# Altium project sdc_prech_proj.PrjPCB (part 1 of 2)
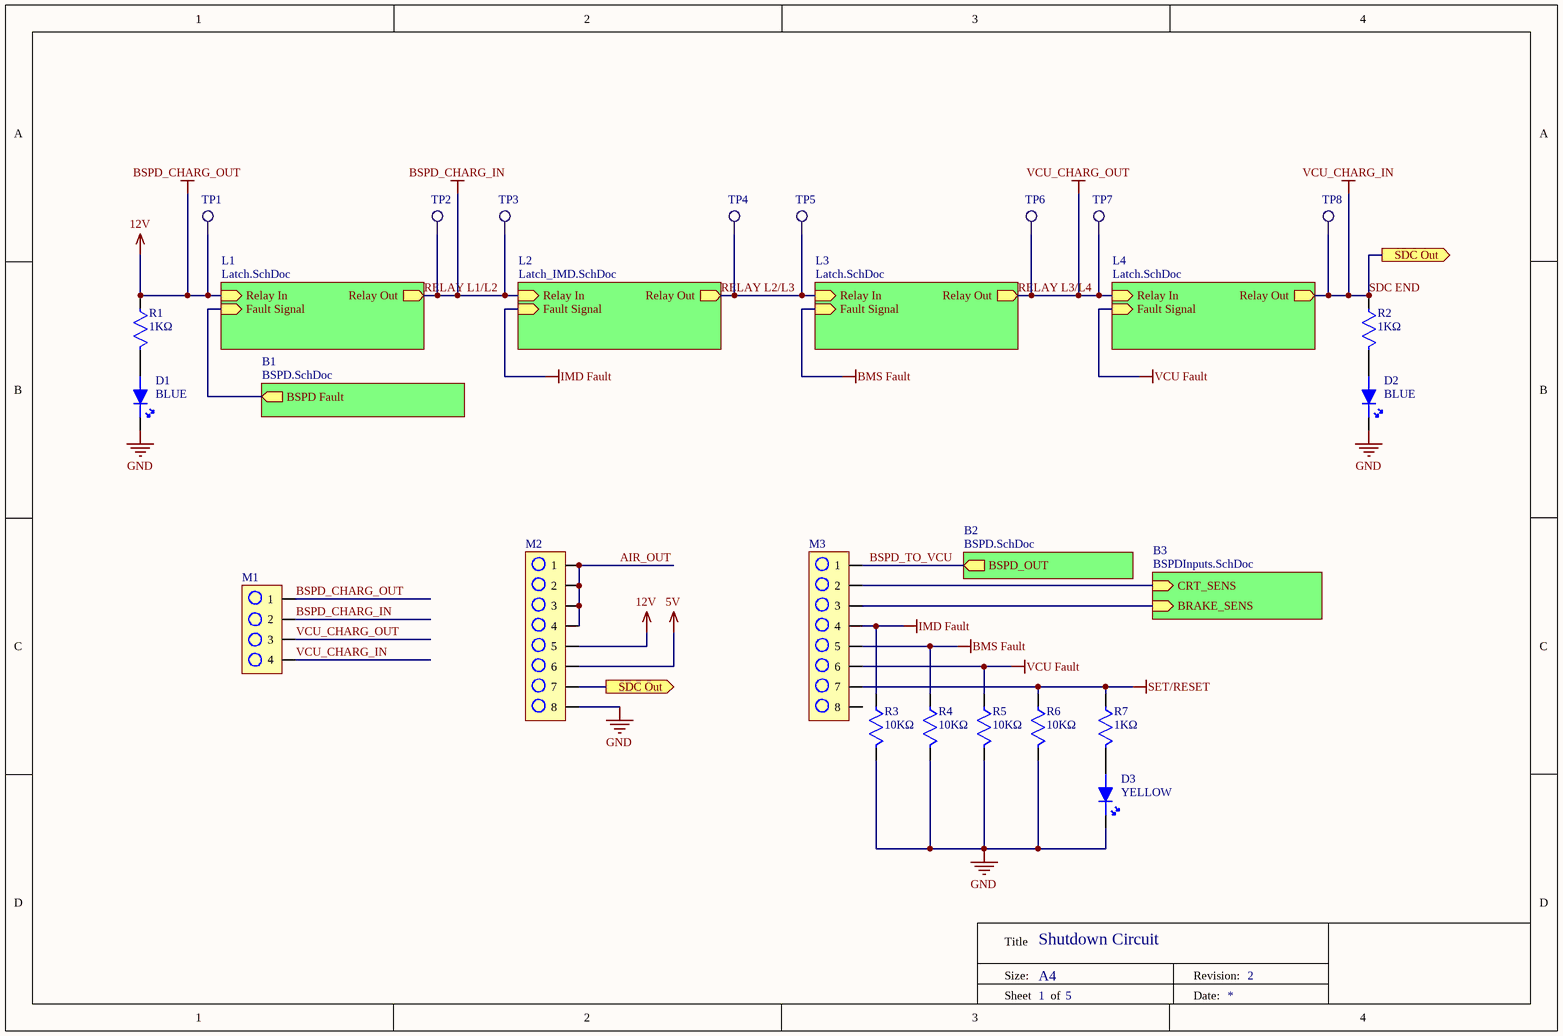
[diagram p0: shutdown_circuit.SchDoc]
5 sheets, 120 parts. Net scope: hierarchical (ports join the sheet entries above them; power ports are global).
Board files: sdc_no-prech_pcb.PcbDoc, sdc_bspd_no-prech_pcb.PcbDoc
Sheets:
  shutdown_circuit.SchDoc
    L1 = Latch.SchDoc
    L2 = Latch_IMD.SchDoc
    L3 = Latch.SchDoc
    L4 = Latch.SchDoc
    B1 = BSPD.SchDoc
      B4 = BSPDInputs.SchDoc
    B3 = BSPDInputs.SchDoc
    B2 = BSPD.SchDoc
      B4 = BSPDInputs.SchDoc

## Sheet shutdown_circuit.SchDoc
size A4

### Parts
D1  BLUE  [LED 0603]
D2  BLUE  [LED 0603]
D3  YELLOW  [LED 0603]
M1  0436500428  [4-PIN MOLEX]  (value not drawn)
M2  2068320802  [4X2-PIN MOLEX]  (value not drawn)
M3  2068320802  [4X2-PIN MOLEX]  (value not drawn)
R1  1KΩ  [RESISTOR 0603]
R2  1KΩ  [RESISTOR 0603]
R3  10KΩ  [RESISTOR 0603]
R4  10KΩ  [RESISTOR 0603]
R5  10KΩ  [RESISTOR 0603]
R6  10KΩ  [RESISTOR 0603]
R7  1KΩ  [RESISTOR 0603]
TP1  Testpoint2  [TP2]  (value not drawn)
TP2  Testpoint2  [TP2]  (value not drawn)
TP3  Testpoint2  [TP2]  (value not drawn)
TP4  Testpoint2  [TP2]  (value not drawn)
TP5  Testpoint2  [TP2]  (value not drawn)
TP6  Testpoint2  [TP2]  (value not drawn)
TP7  Testpoint2  [TP2]  (value not drawn)
TP8  Testpoint2  [TP2]  (value not drawn)

### Sub-sheets
B1 = BSPD.SchDoc: BSPD Fault (out)
B2 = BSPD.SchDoc: BSPD_OUT (out)
B3 = BSPDInputs.SchDoc: CRT_SENS (in), BRAKE_SENS (in)
L1 = Latch.SchDoc: Relay In (in), Relay Out (out), Fault Signal (in)
L2 = Latch_IMD.SchDoc: Relay In (in), Relay Out (out), Fault Signal (in)
L3 = Latch.SchDoc: Relay In (in), Relay Out (out), Fault Signal (in)
L4 = Latch.SchDoc: Relay In (in), Relay Out (out), Fault Signal (in)

### Ports
SDC Out (out)

### Nets
5V: M2.6
BMS Fault: M3.5 R4.1 ; sheet L3/Fault Signal
BSPD_CHARG_IN: M1.2 TP2.1 TP3.1 ; sheet L1/Relay Out, sheet L2/Relay In  [also labelled RELAY L1/L2]
BSPD_CHARG_OUT: M1.1 M2.5 R1.1 TP1.1 ; sheet L1/Relay In  [also labelled 12V]
GND: D1.2 D2.2 D3.2 M2.8 R3.2 R4.2 R5.2 R6.2
IMD Fault: M3.4 R3.1 ; sheet L2/Fault Signal
RELAY L3/L4: M1.3 TP6.1 TP7.1 ; sheet L3/Relay Out, sheet L4/Relay In  [also labelled VCU_CHARG_OUT]
SDC END: M1.4 M2.7 R2.1 TP8.1 ; port SDC Out, sheet L4/Relay Out  [also labelled VCU_CHARG_IN]
SET/RESET: M3.7 R6.1 R7.1
VCU Fault: M3.6 R5.1 ; sheet L4/Fault Signal
AIR_OUT: M2.1 M2.2 M2.3 M2.4
BSPD_TO_VCU: M3.1 ; sheet B2/BSPD_OUT
RELAY L2/L3: TP4.1 TP5.1 ; sheet L2/Relay Out, sheet L3/Relay In
NetD1_1: D1.1 R1.2
NetD2_1: D2.1 R2.2
NetD3_1: D3.1 R7.2
NetM3_2: M3.2 ; sheet B3/CRT_SENS
NetM3_3: M3.3 ; sheet B3/BRAKE_SENS
NetU1_L2_5: sheet L1/Fault Signal, sheet B1/BSPD Fault

Not connected (* = marked no-connect by the designer): M3 8

### Notes on the sheet
- Shutdown Circuit
- 2
- 1
- 5
- Title
- Size:
- A4
- Revision:
- Sheet
- of
- Date:

### Library data of the parts
D1 D2 = LTST-C191TBKT-5A: LED BLUE CLEAR CHIP SMD; Manufacturer: Vishay Lite-On; Lens Color: Colorless; Lens Style: Diffused,Colorless,Rectangular; Viewing Angle: 130°; Forward Current: 20mA; Forward Voltage: 2.8V; Luminous Intensity: 15mcd; Test Current: 5mA; Dominant Wavelength: 473nm; Number of LEDs: 1; Voltage: 29V; Supplier 1: Digi-Key; Manufacturer Part Number: LTST-C191TBKT-5A; Stock 1: 9654; Pricing 1: 1=0.5, 10=0.359, 100=0.1596, 500=0.11172, 1000=0.09177, 2500=0.0798 (USD); Mount: Surface Mount; Case/Package: 0603; Number of Pins: 2; Color: Blue; Case Code (Metric): 1608; Case Code (Imperial): 0603; Min Operating Temperature: -20°C; Max Operating Temperature: 80°C; Packaging: Tape and Reel; Package Quantity: 5000; Illumination Color: Blue; Lens Transparency: Clear; Length: 1.6mm; Height: 0.55mm; Width: 0.8mm; Radiation Hardening: No; ComponentLink1URL: http://optoelectronics.liteon.com/upload/download/DS22-2003-020/LTST-C191TBKT-5A.pdf?src-supplier=Digi-Key; ComponentLink1Description: http://optoelectronics.liteon.com/upload/download/DS22-2003-020/LTST-C191TBKT-5A.pdf?src-supplier=Digi-Key; ComponentLink2URL: http://components.arrow.com/part/dataview/52218576S9813001N1331?src-supplier=Arrow; ComponentLink2Description: http://components.arrow.com/part/dataview/52218576S9813001N1331?src-supplier=Arrow; ComponentLink3URL: http://optoelectronics.liteon.com/zh-cn/api/DwonloadFileHandler.ashx?txtSpecNo=DS22-2003-020&txtPartNo=LTST-C191TBKT-5A&src-supplier=Avnet; ComponentLink3Description: http://optoelectronics.liteon.com/zh-cn/api/DwonloadFileHandler.ashx?txtSpecNo=DS22-2003-020&txtPartNo=LTST-C191TBKT-5A&src-supplier=Avnet; ComponentLink4URL: http://www.mouser.com/ds/2/239/LTST-C191TBKT-5A-1150649.pdf?src-supplier=Mouser; ComponentLink4Description: http://www.mouser.com/ds/2/239/LTST-C191TBKT-5A-1150649.pdf?src-supplier=Mouser; Supplier Part Number 1: 160-2212-6-ND; Category: Optoelectronics
D3 = LTST-C191KSKT: LED YELLOW CLEAR SMD; Manufacturer: Vishay Lite-On; Lens Color: Colorless; Viewing Angle: 130°; Lens Style: Diffused,Colorless,Rectangular,Clear; Luminous Intensity: 180mcd; Forward Current: 30mA; Forward Voltage: 2.4V; Power Rating: 75mW; Dominant Wavelength: 597nm; Test Current: 20mA; Number of Elements: 1; Wavelength: 588nm; Reverse Voltage: 5V; Supplier 1: Digi-Key; Manufacturer Part Number: LTST-C191KSKT; Stock 1: 464545; Pricing 1: 1=0.29, 10=0.215, 100=0.1016, 500=0.06774, 1000=0.05306, 2500=0.05194 (USD); Mount: Surface Mount; Case/Package: 0603; Number of Pins: 2; Color: Yellow; Case Code (Metric): 1608; Case Code (Imperial): 0603; Min Operating Temperature: -55°C; Max Operating Temperature: 85°C; Package Quantity: 1; Packaging: Tape and Reel; Illumination Color: Yellow; Lens Transparency: Clear; Power Dissipation: 75mW; Number of LEDs: 1; Length: 1.6mm; Height: 0.55mm; Width: 0.8mm; Depth: 0.8mm; Radiation Hardening: No; Lead Free: Lead Free; ComponentLink1URL: http://optoelectronics.liteon.com/upload/download/DS22-2000-224/LTST-C191KSKT.PDF?src-supplier=Digi-Key; ComponentLink1Description: http://optoelectronics.liteon.com/upload/download/DS22-2000-224/LTST-C191KSKT.PDF?src-supplier=Digi-Key; ComponentLink2URL: https://www.verical.com/server-webapp/html/getDatasheet?partID=141495&src-supplier=Verical; ComponentLink2Description: https://www.verical.com/server-webapp/html/getDatasheet?partID=141495&src-supplier=Verical; ComponentLink3URL: http://www.mouser.com/ds/2/239/LTST-C191KSKT-1141271.pdf?src-supplier=Mouser; ComponentLink3Description: http://www.mouser.com/ds/2/239/LTST-C191KSKT-1141271.pdf?src-supplier=Mouser; ComponentLink4URL: http://www1.futureelectronics.com/doc/LITE%20ON/LITE-ON%20LTST-C191KSKT.pdf?src-supplier=Future+Electronics; ComponentLink4Description: http://www1.futureelectronics.com/doc/LITE%20ON/LITE-ON%20LTST-C191KSKT.pdf?src-supplier=Future+Electronics; Category: Optoelectronics; Supplier Part Number 1: 160-1448-6-ND
M1 = 0436500428: Conn Power HDR 4 POS 3mm Solder ST Thru-Hole 4 Terminal 1 Port Micro-Fit 3.0™ Tray; Manufacturer: Molex; Number of Positions: 4; Connector Type: Male Pin; Number of Ports: 1; Supplier 1: Digi-Key; Manufacturer Part Number: 0436500428; Stock 1: 1193; Pricing 1: 1=1.44, 10=1.265, 100=1.0916, 500=0.89316, 1000=0.79392, 5000=0.69468, 10000=0.65995 (USD); Mount: Through Hole; Contact Plating: Gold; Color: Black; Contact Material: Brass; Housing Material: Polymer; Number of Terminals: 4; Min Operating Temperature: -40°C; Max Operating Temperature: 105°C; Packaging: Tray; Number of Rows: 1; Termination: Solder; Fastening Type: Ramp; Number of Contacts: 4; Orientation: Straight; Package Quantity: 2040; Length: 15.65mm; Pitch: 3mm; Depth: 5.57mm; ComponentLink1URL: http://www.molex.com/pdm_docs/sd/436500428_sd.pdf?src-supplier=Digi-Key; ComponentLink1Description: http://www.molex.com/pdm_docs/sd/436500428_sd.pdf?src-supplier=Digi-Key; ComponentLink2URL: http://www.molex.com/webdocs/datasheets/pdf/en-us/0436500428_PCB_HEADERS.pdf?src-supplier=Avnet; ComponentLink2Description: http://www.molex.com/webdocs/datasheets/pdf/en-us/0436500428_PCB_HEADERS.pdf?src-supplier=Avnet; Supplier Part Number 1: WM10669-ND; Category: Connectors, Interconnects
M2 M3 = 2068320802: CONN HEADER 4X2 POS, 3.00mm Pitch; Vendor: Molex Connector Corporation; Built_By: Molex_Team; SourceLibrary: Molex_2020-09-22; Manufacturer_Part_Number: 2068320802; Copyright: Copyright (C) 2018 Accelerated Designs. All rights reserved; RefDes: RefDes; Type: DEV
R1 R2 R7 = CRCW06031K00FKEA: RES SMD 1K OHM 1% 1/10W 0603; Manufacturer: Vishay Dale; Resistance: 1kR; Temperature Coefficient: 100ppm/°C; Power Rating: 100mW; Voltage Rating: 75V; Supplier 1: Digi-Key; Manufacturer Part Number: CRCW06031K00FKEA; Stock 1: 1811474; Pricing 1: 1=0.1, 10=0.034, 100=0.0139, 1000=0.00623, 2500=0.0054 (USD); Mount: Surface Mount; Case/Package: 0603; Number of Pins: 2; Weight: 7.1E-05oz; Contact Plating: Tin; Case Code (Metric): 1608; Case Code (Imperial): 0603; Min Operating Temperature: -55°C; Max Operating Temperature: 155°C; Composition: Thick Film; Tolerance: 1%; Termination: SMD/SMT; Packaging: Tape and Reel; Package Quantity: 10; Number of Terminations: 2; Military Standard: Not; Max Power Dissipation: 100mW; Voltage Rating (DC): 75V; Features: Automotive AEC-Q200; Length: 1.55mm; Height: 0.45mm; Width: 0.033inch; Depth: 0.85mm; Radiation Hardening: No; Lead Free: Lead Free; REACH SVHC: Unknown; ComponentLink1URL: http://www.vishay.com/docs/20035/dcrcwe3.pdf?src-supplier=Digi-Key; ComponentLink1Description: http://www.vishay.com/docs/20035/dcrcwe3.pdf?src-supplier=Digi-Key; ComponentLink2URL: http://uk.rs-online.com/webdocs/0d98/0900766b80d98afc.pdf?src-supplier=RSComponents; ComponentLink2Description: http://uk.rs-online.com/webdocs/0d98/0900766b80d98afc.pdf?src-supplier=RSComponents; ComponentLink3URL: http://www.vishay.com/docs/20035/dcrcwe3.pdf?src-supplier=Avnet; ComponentLink3Description: http://www.vishay.com/docs/20035/dcrcwe3.pdf?src-supplier=Avnet; ComponentLink4URL: http://www.vishay.com/docs/20035/dcrcwe3.pdf?src-supplier=Avnet+Asia; ComponentLink4Description: http://www.vishay.com/docs/20035/dcrcwe3.pdf?src-supplier=Avnet+Asia; ComponentLink5URL: http://www.farnell.com/datasheets/2310790.pdf?src-supplier=Element14; ComponentLink5Description: http://www.farnell.com/datasheets/2310790.pdf?src-supplier=Element14; ComponentLink6URL: https://www.distrelec.biz/Web/Downloads/a_/en/flD-CRCW-e3_data_en.pdf?mime=application%2Fpdf&src-supplier=Distrelec; ComponentLink6Description: https://www.distrelec.biz/Web/Downloads/a_/en/flD-CRCW-e3_data_en.pdf?mime=application%2Fpdf&src-supplier=Distrelec; ComponentLink7URL: http://www.vishay.com/docs/20035/dcrcwe3.pdf?src-supplier=Future+Electronics; ComponentLink7Description: http://www.vishay.com/docs/20035/dcrcwe3.pdf?src-supplier=Future+Electronics; ComponentLink8URL: http://www.vishay.com/docs/20035/dcrcwe3.pdf?src-supplier=Avnet+Europe; ComponentLink8Description: http://www.vishay.com/docs/20035/dcrcwe3.pdf?src-supplier=Avnet+Europe; Supplier Part Number 1: 541-1.00KHCT-ND; Category: Resistors
R3-R6 = CRCW060310K0FKEA: RES SMD 10K OHM 1% 1/10W 0603; Manufacturer: Vishay; Resistance: 10kR; Temperature Coefficient: 100ppm/°C; Power Rating: 100mW; Voltage Rating: 75V; Supplier 1: Digi-Key; Manufacturer Part Number: CRCW060310K0FKEA; Stock 1: 1434373; Pricing 1: 1=0.1, 10=0.034, 100=0.0139, 1000=0.00623, 2500=0.0054 (USD); Case/Package: 0603; Number of Pins: 2; Weight: 7.1E-05oz; Contact Plating: Tin,Lead; Case Code (Metric): 1608; Case Code (Imperial): 0603; Min Operating Temperature: -55°C; Max Operating Temperature: 155°C; Tolerance: 1%; Composition: Thick Film; Packaging: Tape and Reel; Package Quantity: 10; Number of Terminations: 2; Military Standard: Not; Termination: SMD/SMT; Max Power Dissipation: 100mW; Voltage Rating (DC): 75V; Features: Automotive AEC-Q200; Length: 1.55mm; Height: 0.45mm; Width: 0.033inch; Depth: 0.85mm; Radiation Hardening: No; Lead Free: Lead Free; REACH SVHC: Unknown; ComponentLink1URL: http://www.vishay.com/docs/20008/dcrcw.pdf?src-supplier=Avnet+Europe; ComponentLink1Description: http://www.vishay.com/docs/20008/dcrcw.pdf?src-supplier=Avnet+Europe; ComponentLink2URL: https://www.verical.com/server-webapp/html/getDatasheet?partID=86831&src-supplier=Verical; ComponentLink2Description: https://www.verical.com/server-webapp/html/getDatasheet?partID=86831&src-supplier=Verical; ComponentLink3URL: http://www.farnell.com/datasheets/2310790.pdf?src-supplier=Allied+Electronics; ComponentLink3Description: http://www.farnell.com/datasheets/2310790.pdf?src-supplier=Allied+Electronics; ComponentLink4URL: http://www.vishay.com/docs/20035/dcrcwe3.pdf?src-supplier=Digi-Key; ComponentLink4Description: http://www.vishay.com/docs/20035/dcrcwe3.pdf?src-supplier=Digi-Key; ComponentLink5URL: http://www.farnell.com/datasheets/2310790.pdf?src-supplier=Mouser; ComponentLink5Description: http://www.farnell.com/datasheets/2310790.pdf?src-supplier=Mouser; ComponentLink6URL: http://www.farnell.com/datasheets/2310790.pdf?src-supplier=Element14; ComponentLink6Description: http://www.farnell.com/datasheets/2310790.pdf?src-supplier=Element14; ComponentLink7URL: http://www.farnell.com/datasheets/2310790.pdf?src-supplier=Avnet; ComponentLink7Description: http://www.farnell.com/datasheets/2310790.pdf?src-supplier=Avnet; ComponentLink8URL: http://www.vishay.com/docs/20035/dcrcwe3.pdf?src-supplier=Future+Electronics; ComponentLink8Description: http://www.vishay.com/docs/20035/dcrcwe3.pdf?src-supplier=Future+Electronics; ComponentLink9URL: http://uk.rs-online.com/webdocs/0d98/0900766b80d98afc.pdf?src-supplier=RSComponents; ComponentLink9Description: http://uk.rs-online.com/webdocs/0d98/0900766b80d98afc.pdf?src-supplier=RSComponents; ComponentLink10URL: http://www.farnell.com/datasheets/2310790.pdf?src-supplier=Distrelec; ComponentLink10Description: http://www.farnell.com/datasheets/2310790.pdf?src-supplier=Distrelec; Supplier Part Number 1: 541-10.0KHCT-ND; Category: Resistors
TP1-TP8 = Testpoint2: Single layer pad TP

## Sheet Latch.SchDoc
size A4
Used 3 times, as channels L1, L3, L4. Parts and nets are listed once, with the designators drawn on the sheet.
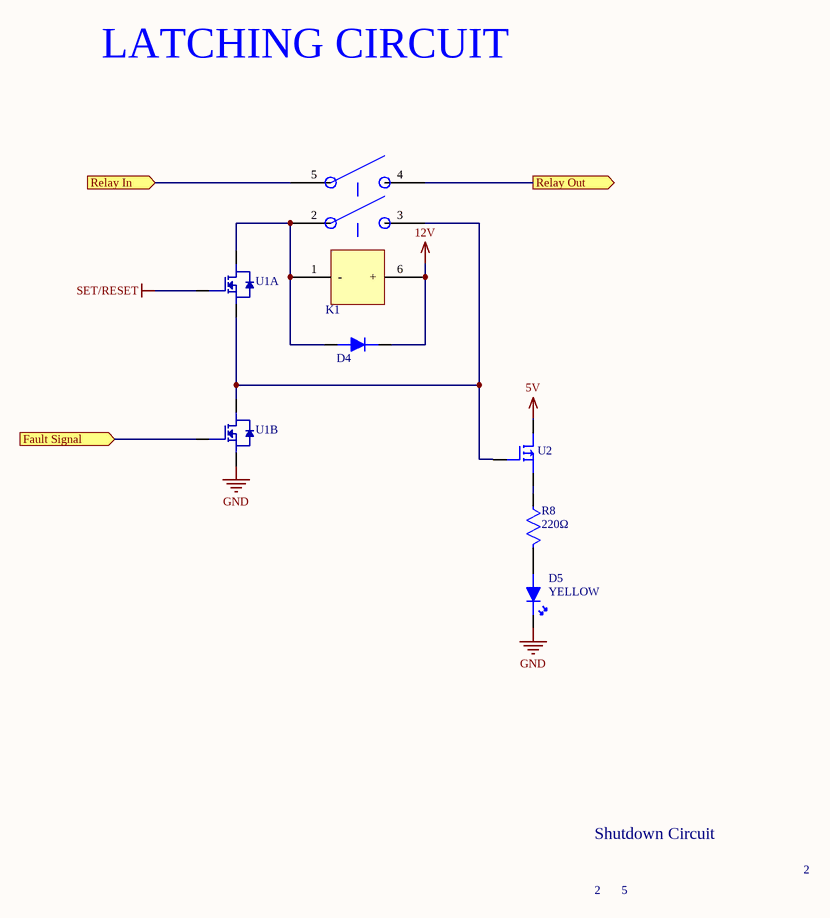
[diagram p1: Latch.SchDoc]

### Parts
D4  SD560BTR  [DIODE]  (value not drawn)
D5  YELLOW  [LED 0603]
K1  5-1419124-6  [RELAY DPST SDC]  (value not drawn)
R8  220Ω  [RESISTOR 0603]
U1  SSM6N7002CFU,LF  [N-MOSFET (2 FETS)]  (value not drawn)  (parts A,B of 2)
U2  NTD2955T4GOSCT-ND  [DPAK-TO252]  (value not drawn)

### Ports
Fault Signal (in), Relay In (in), Relay Out (out)

### Nets
5V: U2.2
12V: D4.2 K1.6(+)
GND: D5.2 U1.4(S2)
SET/RESET: U1.2(G1)
Fault Signal: U1.5(G2) ; port Fault Signal
Relay In: K1.5 ; port Relay In
Relay Out: K1.4 ; port Relay Out
NetD4_1: D4.1 K1.1(-) K1.2 U1.6(D1)
NetD5_1: D5.1 R8.2
NetK1_3: K1.3 U1.1(S1) U1.3(D2)
NetR8_1: R8.1 U2.3

Not connected (* = marked no-connect by the designer): U2 1

### Channels
L1: designators D4=D8_L2 D5=D5_L1 K1=K1_L2 R8=R8_L1 U1=U1_L2 U2=U2_L1; ports Fault Signal=NetU1_L2_5 Relay In=BSPD_CHARG_OUT Relay Out=BSPD_CHARG_IN
L3: designators D4=D8_L3 D5=D5_L3 K1=K1_L3 R8=R8_L3 U1=U1_L3 U2=U2_L3; ports Fault Signal=BMS Fault Relay In=RELAY L2/L3 Relay Out=RELAY L3/L4
L4: designators D4=D8_L4 D5=D5_L4 K1=K1_L4 R8=R8_L4 U1=U1_L4 U2=U2_L4; ports Fault Signal=VCU Fault Relay In=RELAY L3/L4 Relay Out=SDC END

### Notes on the sheet
- LATCHING CIRCUIT
- Shutdown Circuit
- 2
- 5
- Title
- Size:
- A4
- Revision:
- Sheet
- of
- Date:

### Library data of the parts
D4 = SD560BTR: DIODE GEN PURP 600V 5A SMB; Manufacturer: SMC; Supplier 1: Digi-Key; Manufacturer Part Number: SD560BTR; Stock 1: 90144; Pricing 1: 1=0.42, 10=0.309, 100=0.1468, 500=0.11978, 1000=0.08887 (USD); Mount: Surface Mount; Packaging: Tape and Reel; Max Reverse Voltage (DC): 600V; ComponentLink1URL: http://www.smc-diodes.com/propdf/SD560B%20N1412%20REV.D.pdf?src-supplier=Digi-Key; ComponentLink1Description: http://www.smc-diodes.com/propdf/SD560B%20N1412%20REV.D.pdf?src-supplier=Digi-Key; Supplier Part Number 1: 1655-1530-6-ND; Category: Discrete Semiconductor Products; Average Rectified Current: 5A; Case/Package: SMB
D5 = LTST-C191KSKT: as D3 on sheet shutdown_circuit; Supplier 1: Digi-Key; Manufacturer Part Number: LTST-C191KSKT; Stock 1: 464545; Pricing 1: 1=0.29, 10=0.215, 100=0.1016, 500=0.06774, 1000=0.05306, 2500=0.05194 (USD); Mount: Surface Mount; Case/Package: 0603; Number of Pins: 2; Color: Yellow; Case Code (Metric): 1608; Case Code (Imperial): 0603; Min Operating Temperature: -55°C; Max Operating Temperature: 85°C; Package Quantity: 1; Packaging: Tape and Reel; Illumination Color: Yellow; Lens Transparency: Clear; Power Dissipation: 75mW; Number of LEDs: 1; Length: 1.6mm; Height: 0.55mm; Width: 0.8mm; Depth: 0.8mm; Radiation Hardening: No; Lead Free: Lead Free; ComponentLink1URL: http://optoelectronics.liteon.com/upload/download/DS22-2000-224/LTST-C191KSKT.PDF?src-supplier=Digi-Key; ComponentLink1Description: http://optoelectronics.liteon.com/upload/download/DS22-2000-224/LTST-C191KSKT.PDF?src-supplier=Digi-Key; ComponentLink2URL: https://www.verical.com/server-webapp/html/getDatasheet?partID=141495&src-supplier=Verical; ComponentLink2Description: https://www.verical.com/server-webapp/html/getDatasheet?partID=141495&src-supplier=Verical; ComponentLink3URL: http://www.mouser.com/ds/2/239/LTST-C191KSKT-1141271.pdf?src-supplier=Mouser; ComponentLink3Description: http://www.mouser.com/ds/2/239/LTST-C191KSKT-1141271.pdf?src-supplier=Mouser; ComponentLink4URL: http://www1.futureelectronics.com/doc/LITE%20ON/LITE-ON%20LTST-C191KSKT.pdf?src-supplier=Future+Electronics; ComponentLink4Description: http://www1.futureelectronics.com/doc/LITE%20ON/LITE-ON%20LTST-C191KSKT.pdf?src-supplier=Future+Electronics; Category: Optoelectronics; Supplier Part Number 1: 160-1448-6-ND
K1 = 5-1419124-6: General Purpose Relay, Osa Series, Power, Non Latching, Dpst-No, 12 Vdc, 3 A Rohs Compliant: Yes; Manufacturer: TE Connectivity; Contact Current Rating: 3A; Coil Current: 45mA; Throw Configuration: DPST; Operate Time: 20ms; Release Time: 10ms; Coil Power: 600mW; Coil Resistance: 270R; Coil Type: Non-Latching; Coil Voltage (DC): 12V; Contact Voltage Rating (AC): 240V; Supplier 1: Digi-Key; Manufacturer Part Number: 5-1419124-6; Stock 1: 2593; Pricing 1: 1=2.54, 10=2.385, 25=2.1204, 50=2.0142, 100=1.9083, 250=1.69624, 500=1.59022, 1000=1.48421, 5000=1.4312 (USD); Mount: Through Hole; Weight: 13g; Contact Material: Silver; Min Operating Temperature: -30°C; Max Operating Temperature: 60°C; Package Quantity: 1000; Packaging: Box; Termination: PCB; Relay Type: General Purpose; Length: 24.4mm; Height: 0.976inch; Width: 12.9mm; ELV: Compliant; REACH SVHC: Unknown; ComponentLink1URL: http://www.farnell.com/datasheets/1652820.pdf?src-supplier=Farnell; ComponentLink1Description: http://www.farnell.com/datasheets/1652820.pdf?src-supplier=Farnell; ComponentLink2URL: http://www.farnell.com/cad/1652820.pdf?src-supplier=Element14; ComponentLink2Description: http://www.farnell.com/cad/1652820.pdf?src-supplier=Element14; ComponentLink3URL: http://www.te.com/commerce/DocumentDelivery/DDEController?Action=srchrtrv&DocNm=5-1419124-6&DocType=Customer+Drawing&DocLang=English&src-supplier=Digi-Key; ComponentLink3Description: http://www.te.com/commerce/DocumentDelivery/DDEController?Action=srchrtrv&DocNm=5-1419124-6&DocType=Customer+Drawing&DocLang=English&src-supplier=Digi-Key; Supplier Part Number 1: OSA-SS-212DM3,000-ND; Category: Relays
R8 = CRCW0603220RJNEA: RES SMD 220 OHM 5% 1/10W 0603; Manufacturer: Vishay; Resistance: 220R; Power Rating: 100mW; Voltage Rating: 75V; Temperature Coefficient: 200ppm/°C; Supplier 1: Digi-Key; Manufacturer Part Number: CRCW0603220RJNEA; Stock 1: 171552; Pricing 1: 1=0.1, 10=0.031, 100=0.0125, 1000=0.00562, 2500=0.00488 (USD); Mount: Surface Mount; Case/Package: 0603; Weight: 7.1E-05oz; Case Code (Metric): 1608; Case Code (Imperial): 0603; Contact Plating: Tin; Min Operating Temperature: -55°C; Max Operating Temperature: 155°C; Tolerance: 5%; Packaging: Tape and Reel; Package Quantity: 1; Composition: Thick Film; Number of Terminations: 2; Military Standard: Not; Termination: SMD/SMT; Max Power Dissipation: 100mW; Working Voltage: 75V; Features: Automotive AEC-Q200; Length: 1.55mm; Height: 0.45mm; Width: 0.033inch; Depth: 0.85mm; Radiation Hardening: No; REACH SVHC: Unknown; ComponentLink1URL: http://www.vishay.com/docs/20035/dcrcwe3.pdf?src-supplier=Digi-Key; ComponentLink1Description: http://www.vishay.com/docs/20035/dcrcwe3.pdf?src-supplier=Digi-Key; ComponentLink2URL: http://www.vishay.com/docs/20035/dcrcwe3.pdf?src-supplier=Avnet; ComponentLink2Description: http://www.vishay.com/docs/20035/dcrcwe3.pdf?src-supplier=Avnet; ComponentLink3URL: http://www.alliedelec.com/m/d/0c934d6939ccefa68dbe0b96d821c8cf.pdf?src-supplier=Allied+Electronics; ComponentLink3Description: http://www.alliedelec.com/m/d/0c934d6939ccefa68dbe0b96d821c8cf.pdf?src-supplier=Allied+Electronics; ComponentLink4URL: http://www.farnell.com/datasheets/2045673.pdf?src-supplier=Element14; ComponentLink4Description: http://www.farnell.com/datasheets/2045673.pdf?src-supplier=Element14; ComponentLink5URL: http://www.mouser.com/ds/2/427/dcrcwe3-109170.pdf?src-supplier=Mouser; ComponentLink5Description: http://www.mouser.com/ds/2/427/dcrcwe3-109170.pdf?src-supplier=Mouser; Supplier Part Number 1: 541-220GCT-ND; Category: Resistors
U1 = SSM6N7002CFU,LF: MOSFET 2N-CH 60V 0.17A US6; Manufacturer: Toshiba; Continuous Drain Current (ID): 170mA; Rds On Max: 3.9R; Input Capacitance: 17pF; Max Power Dissipation: 285mW; FET Type: 2 N-Channel; Supplier 1: Digi-Key; Manufacturer Part Number: SSM6N7002CFU,LF; Stock 1: 13946; Pricing 1: 1=0.27, 10=0.221, 100=0.0906, 500=0.0756, 1000=0.05253 (USD); Mount: Surface Mount; Case/Package: SOT-363; Packaging: Tape and Reel; Drain to Source Voltage (Vdss): 60V; ComponentLink1URL: https://toshiba.semicon-storage.com/info/docget.jsp?did=29875&prodName=SSM6N7002CFU&src-supplier=Digi-Key; ComponentLink1Description: https://toshiba.semicon-storage.com/info/docget.jsp?did=29875&prodName=SSM6N7002CFU&src-supplier=Digi-Key; ComponentLink2URL: http://www.mouser.com/ds/2/408/SSM6N7002CFU_datasheet_en_20150413-736631.pdf?src-supplier=Mouser; ComponentLink2Description: http://www.mouser.com/ds/2/408/SSM6N7002CFU_datasheet_en_20150413-736631.pdf?src-supplier=Mouser; Category: Discrete Semiconductor Products; Supplier Part Number 1: SSM6N7002CFULFDKR-ND
U2 = P-FET-60V-12A: MOSFET P-CH 60V 12A DPAK; Manufacturer: ON Semiconductor; Rise Time: 45ns; Nominal Vgs: -2.8V; Input Capacitance: 750pF; Max Power Dissipation: 55W; Number of Elements: 1; Rds On Max: 180mR; Fall Time: 48ns; Drain to Source Resistance: 155mR; Turn-Off Delay Time: 26ns; Drain to Source Voltage (Vdss): -60V; Turn-On Delay Time: 10ns; Element Configuration: Single; Gate to Source Voltage (Vgs): 20V; Current Rating: -12A; Supplier 1: Digi-Key; Manufacturer Part Number: NTD2955T4G; Stock 1: 9993; Pricing 1: 1=0.76, 10=0.672, 25=0.6316, 100=0.4583, 250=0.44204, 500=0.38296, 1000=0.32592 (USD); Case/Package: DPAK; Number of Pins: 3; Contact Plating: Tin,Matte; Min Operating Temperature: -55°C; Max Operating Temperature: 175°C; Package Quantity: 1; Packaging: Tape and Reel; Power Dissipation: 55W; Continuous Drain Current (ID): 12A; Threshold Voltage: -2.8V; Drain to Source Breakdown Voltage: -60V; Voltage Rating (DC): -60V; On-State Resistance: 180mR; Number of Channels: 1; Length: 6.73mm; Height: 2.38mm; Width: 6.22mm; Radiation Hardening: No; REACH SVHC: No SVHC; Lead Free: Lead Free; ComponentLink1URL: http://www.onsemi.com/pub/Collateral/NTD2955-D.PDF?src-supplier=Avnet; ComponentLink1Description: http://www.onsemi.com/pub/Collateral/NTD2955-D.PDF?src-supplier=Avnet; ComponentLink2URL: http://www.onsemi.com/pub/Collateral/NTD2955-D.PDF?src-supplier=Avnet+Europe; ComponentLink2Description: http://www.onsemi.com/pub/Collateral/NTD2955-D.PDF?src-supplier=Avnet+Europe; ComponentLink3URL: http://www.onsemi.com/pub_link/Collateral/NTD2955-D.PDF?src-supplier=Element14; ComponentLink3Description: http://www.onsemi.com/pub_link/Collateral/NTD2955-D.PDF?src-supplier=Element14; ComponentLink4URL: http://www.onsemi.com/pub/Collateral/NTD2955-D.PDF?src-supplier=Digi-Key; ComponentLink4Description: http://www.onsemi.com/pub/Collateral/NTD2955-D.PDF?src-supplier=Digi-Key; ComponentLink5URL: http://www.jameco.com/Jameco/Products/ProdDS/1178118.pdf?src-supplier=Jameco; ComponentLink5Description: http://www.jameco.com/Jameco/Products/ProdDS/1178118.pdf?src-supplier=Jameco; Supplier Part Number 1: NTD2955T4GOSDKR-ND

## Sheet Latch_IMD.SchDoc
size A4
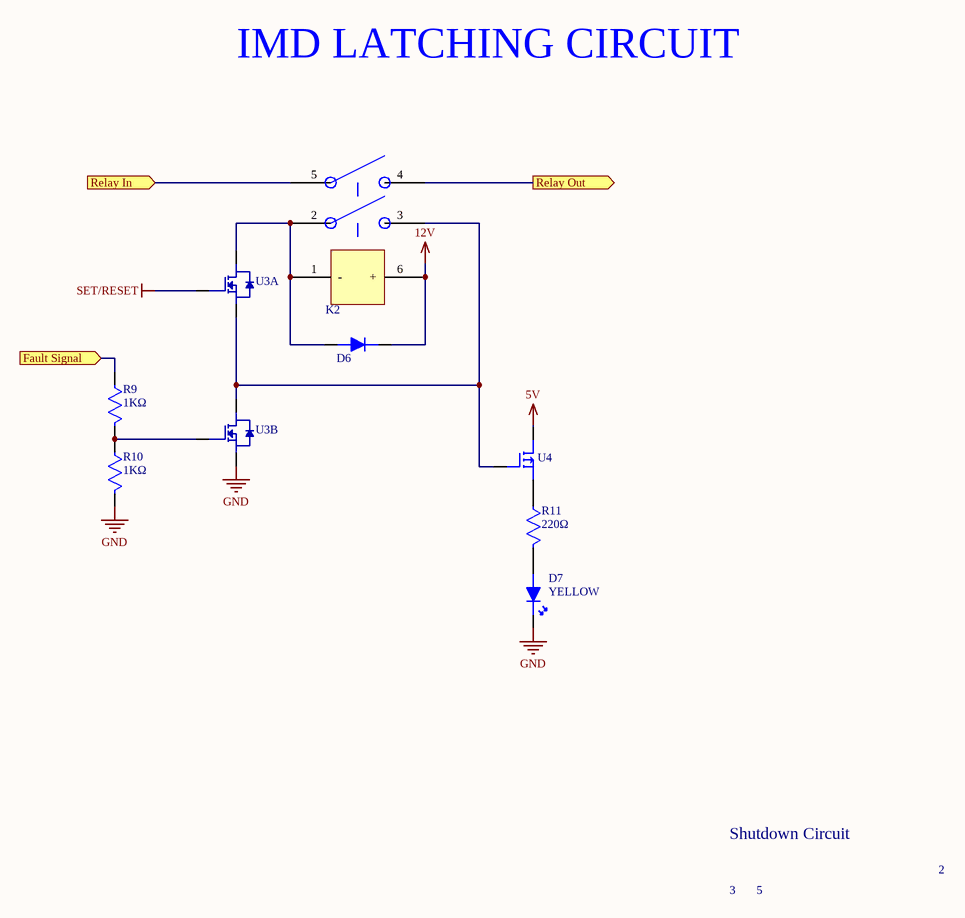
[diagram p2: Latch_IMD.SchDoc]

### Parts
D6  SD560BTR  [DIODE]  (value not drawn)
D7  YELLOW  [LED 0603]
K2  5-1419124-6  [RELAY DPST SDC]  (value not drawn)
R9  1KΩ  [RESISTOR 0603]
R10  1KΩ  [RESISTOR 0603]
R11  220Ω  [RESISTOR 0603]
U3  SSM6N7002CFU,LF  [N-MOSFET (2 FETS)]  (value not drawn)  (parts A,B of 2)
U4  NTD2955T4GOSCT-ND  [DPAK-TO252]  (value not drawn)

### Ports
Fault Signal (in), Relay In (in), Relay Out (out)

### Nets
5V: U4.2
12V: D6.2 K2.6(+)  [project net BSPD_CHARG_OUT]
BSPD_CHARG_IN: K2.5 ; port Relay In
GND: D7.2 R10.2 U3.4(S2)
IMD Fault: R9.1 ; port Fault Signal
SET/RESET: U3.2(G1)
RELAY L2/L3: K2.4 ; port Relay Out
NetD6_1: D6.1 K2.1(-) K2.2 U3.6(D1)
NetD7_1: D7.1 R11.2
NetK2_3: K2.3 U3.1(S1) U3.3(D2) U4.1
NetR9_2: R9.2 R10.1 U3.5(G2)
NetR11_1: R11.1 U4.3

### Notes on the sheet
- IMD LATCHING CIRCUIT
- Shutdown Circuit
- 2
- 3
- 5
- Title
- Size:
- A4
- Revision:
- Sheet
- of
- Date:

### Library data of the parts
D6 = SD560BTR: as D4 on sheet Latch; Supplier 1: Digi-Key; Manufacturer Part Number: SD560BTR; Stock 1: 90144; Pricing 1: 1=0.42, 10=0.309, 100=0.1468, 500=0.11978, 1000=0.08887 (USD); Mount: Surface Mount; Packaging: Tape and Reel; Max Reverse Voltage (DC): 600V; ComponentLink1URL: http://www.smc-diodes.com/propdf/SD560B%20N1412%20REV.D.pdf?src-supplier=Digi-Key; ComponentLink1Description: http://www.smc-diodes.com/propdf/SD560B%20N1412%20REV.D.pdf?src-supplier=Digi-Key; Supplier Part Number 1: 1655-1530-6-ND; Category: Discrete Semiconductor Products; Average Rectified Current: 5A; Case/Package: SMB
D7 = LTST-C191KSKT: as D3 on sheet shutdown_circuit; Supplier 1: Digi-Key; Manufacturer Part Number: LTST-C191KSKT; Stock 1: 464545; Pricing 1: 1=0.29, 10=0.215, 100=0.1016, 500=0.06774, 1000=0.05306, 2500=0.05194 (USD); Mount: Surface Mount; Case/Package: 0603; Number of Pins: 2; Color: Yellow; Case Code (Metric): 1608; Case Code (Imperial): 0603; Min Operating Temperature: -55°C; Max Operating Temperature: 85°C; Package Quantity: 1; Packaging: Tape and Reel; Illumination Color: Yellow; Lens Transparency: Clear; Power Dissipation: 75mW; Number of LEDs: 1; Length: 1.6mm; Height: 0.55mm; Width: 0.8mm; Depth: 0.8mm; Radiation Hardening: No; Lead Free: Lead Free; ComponentLink1URL: http://optoelectronics.liteon.com/upload/download/DS22-2000-224/LTST-C191KSKT.PDF?src-supplier=Digi-Key; ComponentLink1Description: http://optoelectronics.liteon.com/upload/download/DS22-2000-224/LTST-C191KSKT.PDF?src-supplier=Digi-Key; ComponentLink2URL: https://www.verical.com/server-webapp/html/getDatasheet?partID=141495&src-supplier=Verical; ComponentLink2Description: https://www.verical.com/server-webapp/html/getDatasheet?partID=141495&src-supplier=Verical; ComponentLink3URL: http://www.mouser.com/ds/2/239/LTST-C191KSKT-1141271.pdf?src-supplier=Mouser; ComponentLink3Description: http://www.mouser.com/ds/2/239/LTST-C191KSKT-1141271.pdf?src-supplier=Mouser; ComponentLink4URL: http://www1.futureelectronics.com/doc/LITE%20ON/LITE-ON%20LTST-C191KSKT.pdf?src-supplier=Future+Electronics; ComponentLink4Description: http://www1.futureelectronics.com/doc/LITE%20ON/LITE-ON%20LTST-C191KSKT.pdf?src-supplier=Future+Electronics; Category: Optoelectronics; Supplier Part Number 1: 160-1448-6-ND
K2 = 5-1419124-6: as K1 on sheet Latch; Supplier 1: Digi-Key; Manufacturer Part Number: 5-1419124-6; Stock 1: 2593; Pricing 1: 1=2.54, 10=2.385, 25=2.1204, 50=2.0142, 100=1.9083, 250=1.69624, 500=1.59022, 1000=1.48421, 5000=1.4312 (USD); Mount: Through Hole; Weight: 13g; Contact Material: Silver; Min Operating Temperature: -30°C; Max Operating Temperature: 60°C; Package Quantity: 1000; Packaging: Box; Termination: PCB; Relay Type: General Purpose; Length: 24.4mm; Height: 0.976inch; Width: 12.9mm; ELV: Compliant; REACH SVHC: Unknown; ComponentLink1URL: http://www.farnell.com/datasheets/1652820.pdf?src-supplier=Farnell; ComponentLink1Description: http://www.farnell.com/datasheets/1652820.pdf?src-supplier=Farnell; ComponentLink2URL: http://www.farnell.com/cad/1652820.pdf?src-supplier=Element14; ComponentLink2Description: http://www.farnell.com/cad/1652820.pdf?src-supplier=Element14; ComponentLink3URL: http://www.te.com/commerce/DocumentDelivery/DDEController?Action=srchrtrv&DocNm=5-1419124-6&DocType=Customer+Drawing&DocLang=English&src-supplier=Digi-Key; ComponentLink3Description: http://www.te.com/commerce/DocumentDelivery/DDEController?Action=srchrtrv&DocNm=5-1419124-6&DocType=Customer+Drawing&DocLang=English&src-supplier=Digi-Key; Supplier Part Number 1: OSA-SS-212DM3,000-ND; Category: Relays
R9-R11 = CRCW0603220RJNEA: as R8 on sheet Latch; Supplier 1: Digi-Key; Manufacturer Part Number: CRCW0603220RJNEA; Stock 1: 171552; Pricing 1: 1=0.1, 10=0.031, 100=0.0125, 1000=0.00562, 2500=0.00488 (USD); Mount: Surface Mount; Case/Package: 0603; Weight: 7.1E-05oz; Case Code (Metric): 1608; Case Code (Imperial): 0603; Contact Plating: Tin; Min Operating Temperature: -55°C; Max Operating Temperature: 155°C; Tolerance: 5%; Packaging: Tape and Reel; Package Quantity: 1; Composition: Thick Film; Number of Terminations: 2; Military Standard: Not; Termination: SMD/SMT; Max Power Dissipation: 100mW; Working Voltage: 75V; Features: Automotive AEC-Q200; Length: 1.55mm; Height: 0.45mm; Width: 0.033inch; Depth: 0.85mm; Radiation Hardening: No; REACH SVHC: Unknown; ComponentLink1URL: http://www.vishay.com/docs/20035/dcrcwe3.pdf?src-supplier=Digi-Key; ComponentLink1Description: http://www.vishay.com/docs/20035/dcrcwe3.pdf?src-supplier=Digi-Key; ComponentLink2URL: http://www.vishay.com/docs/20035/dcrcwe3.pdf?src-supplier=Avnet; ComponentLink2Description: http://www.vishay.com/docs/20035/dcrcwe3.pdf?src-supplier=Avnet; ComponentLink3URL: http://www.alliedelec.com/m/d/0c934d6939ccefa68dbe0b96d821c8cf.pdf?src-supplier=Allied+Electronics; ComponentLink3Description: http://www.alliedelec.com/m/d/0c934d6939ccefa68dbe0b96d821c8cf.pdf?src-supplier=Allied+Electronics; ComponentLink4URL: http://www.farnell.com/datasheets/2045673.pdf?src-supplier=Element14; ComponentLink4Description: http://www.farnell.com/datasheets/2045673.pdf?src-supplier=Element14; ComponentLink5URL: http://www.mouser.com/ds/2/427/dcrcwe3-109170.pdf?src-supplier=Mouser; ComponentLink5Description: http://www.mouser.com/ds/2/427/dcrcwe3-109170.pdf?src-supplier=Mouser; Supplier Part Number 1: 541-220GCT-ND; Category: Resistors
U3 = SSM6N7002CFU,LF: as U1 on sheet Latch; Supplier 1: Digi-Key; Manufacturer Part Number: SSM6N7002CFU,LF; Stock 1: 13946; Pricing 1: 1=0.27, 10=0.221, 100=0.0906, 500=0.0756, 1000=0.05253 (USD); Mount: Surface Mount; Case/Package: SOT-363; Packaging: Tape and Reel; Drain to Source Voltage (Vdss): 60V; ComponentLink1URL: https://toshiba.semicon-storage.com/info/docget.jsp?did=29875&prodName=SSM6N7002CFU&src-supplier=Digi-Key; ComponentLink1Description: https://toshiba.semicon-storage.com/info/docget.jsp?did=29875&prodName=SSM6N7002CFU&src-supplier=Digi-Key; ComponentLink2URL: http://www.mouser.com/ds/2/408/SSM6N7002CFU_datasheet_en_20150413-736631.pdf?src-supplier=Mouser; ComponentLink2Description: http://www.mouser.com/ds/2/408/SSM6N7002CFU_datasheet_en_20150413-736631.pdf?src-supplier=Mouser; Category: Discrete Semiconductor Products; Supplier Part Number 1: SSM6N7002CFULFDKR-ND
U4 = P-FET-60V-12A: as U2 on sheet Latch; Supplier 1: Digi-Key; Manufacturer Part Number: NTD2955T4G; Stock 1: 9993; Pricing 1: 1=0.76, 10=0.672, 25=0.6316, 100=0.4583, 250=0.44204, 500=0.38296, 1000=0.32592 (USD); Case/Package: DPAK; Number of Pins: 3; Contact Plating: Tin,Matte; Min Operating Temperature: -55°C; Max Operating Temperature: 175°C; Package Quantity: 1; Packaging: Tape and Reel; Power Dissipation: 55W; Continuous Drain Current (ID): 12A; Threshold Voltage: -2.8V; Drain to Source Breakdown Voltage: -60V; Voltage Rating (DC): -60V; On-State Resistance: 180mR; Number of Channels: 1; Length: 6.73mm; Height: 2.38mm; Width: 6.22mm; Radiation Hardening: No; REACH SVHC: No SVHC; Lead Free: Lead Free; ComponentLink1URL: http://www.onsemi.com/pub/Collateral/NTD2955-D.PDF?src-supplier=Avnet; ComponentLink1Description: http://www.onsemi.com/pub/Collateral/NTD2955-D.PDF?src-supplier=Avnet; ComponentLink2URL: http://www.onsemi.com/pub/Collateral/NTD2955-D.PDF?src-supplier=Avnet+Europe; ComponentLink2Description: http://www.onsemi.com/pub/Collateral/NTD2955-D.PDF?src-supplier=Avnet+Europe; ComponentLink3URL: http://www.onsemi.com/pub_link/Collateral/NTD2955-D.PDF?src-supplier=Element14; ComponentLink3Description: http://www.onsemi.com/pub_link/Collateral/NTD2955-D.PDF?src-supplier=Element14; ComponentLink4URL: http://www.onsemi.com/pub/Collateral/NTD2955-D.PDF?src-supplier=Digi-Key; ComponentLink4Description: http://www.onsemi.com/pub/Collateral/NTD2955-D.PDF?src-supplier=Digi-Key; ComponentLink5URL: http://www.jameco.com/Jameco/Products/ProdDS/1178118.pdf?src-supplier=Jameco; ComponentLink5Description: http://www.jameco.com/Jameco/Products/ProdDS/1178118.pdf?src-supplier=Jameco; Supplier Part Number 1: NTD2955T4GOSDKR-ND